# Altium project 2021.PrjPcb
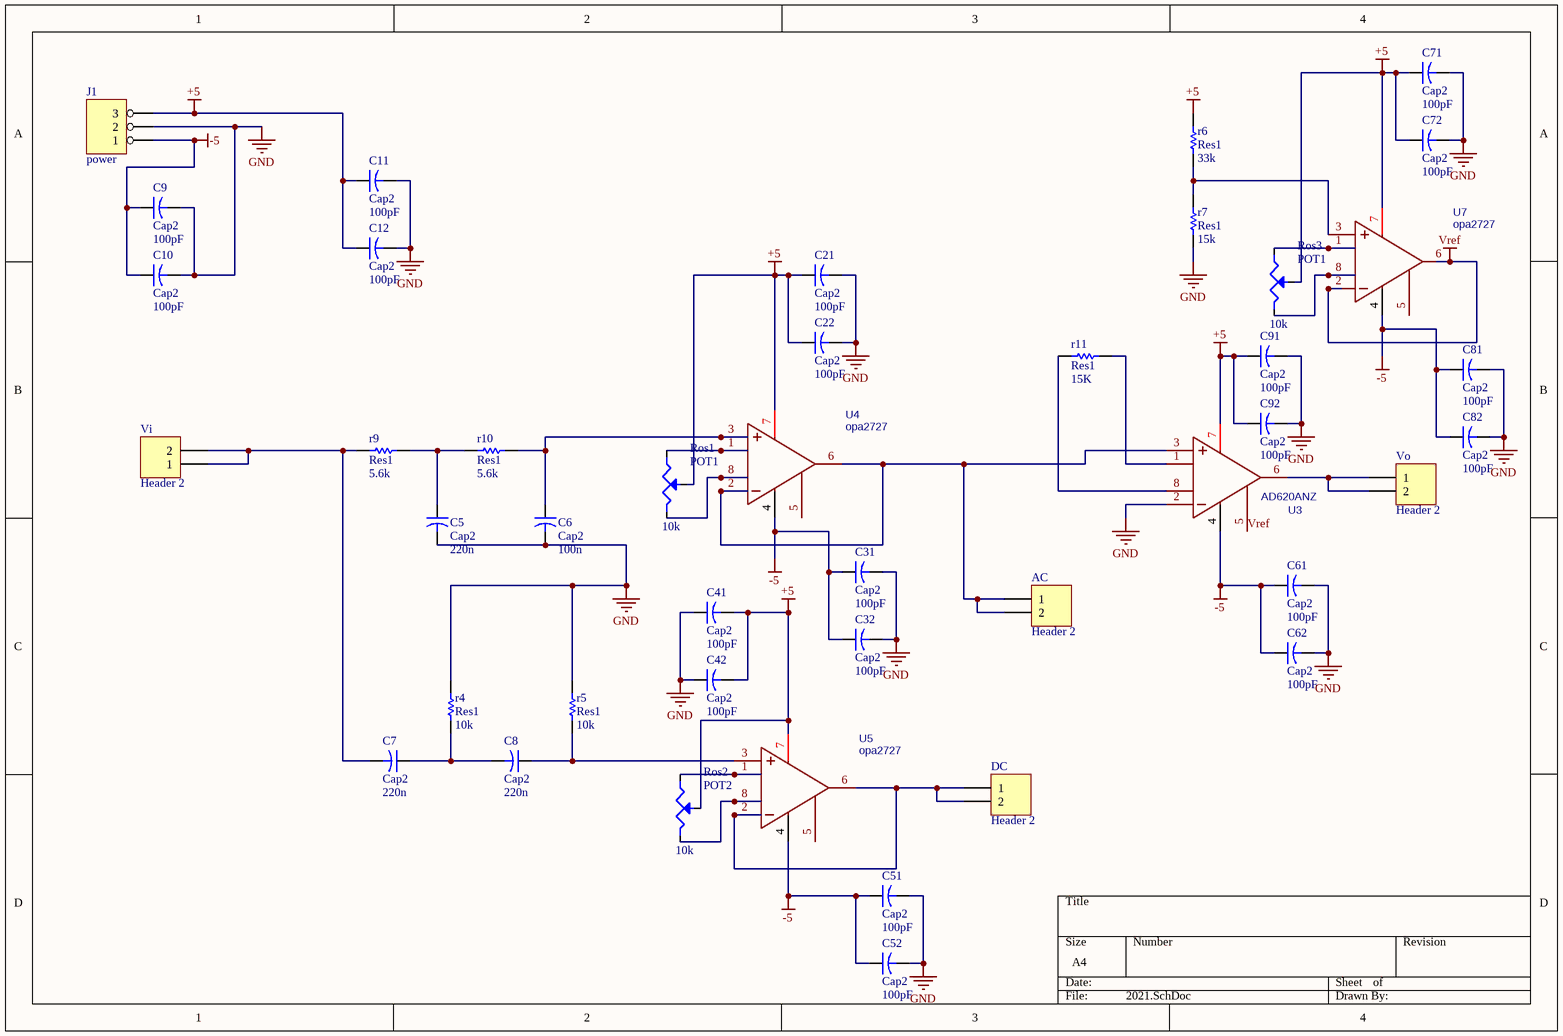
[diagram p0: 2021.SchDoc]
1 sheet, 43 parts. Net scope: global (net labels, ports and power ports of the same name join across sheets).
Board file: 21A.PcbDoc

## Sheet 2021.SchDoc
size A4

### Parts
AC  Header 2  [HDR1X2]
C5  Cap2  value 220n  [RAD0.2]
C6  Cap2  value 100n  [RAD0.2]
C7  Cap2  value 220n  [RAD0.2]
C8  Cap2  value 220n  [RAD0.2]
C9  Cap2  value 100pF  [RAD0.2]
C10  Cap2  value 100pF  [RAD0.2]
C11  Cap2  value 100pF  [RAD0.2]
C12  Cap2  value 100pF  [RAD0.2]
C21  Cap2  value 100pF  [RAD0.2]
C22  Cap2  value 100pF  [RAD0.2]
C31  Cap2  value 100pF  [RAD0.2]
C32  Cap2  value 100pF  [RAD0.2]
C41  Cap2  value 100pF  [RAD0.2]
C42  Cap2  value 100pF  [RAD0.2]
C51  Cap2  value 100pF  [RAD0.2]
C52  Cap2  value 100pF  [RAD0.2]
C61  Cap2  value 100pF  [RAD0.2]
C62  Cap2  value 100pF  [RAD0.2]
C71  Cap2  value 100pF  [RAD0.2]
C72  Cap2  value 100pF  [RAD0.2]
C81  Cap2  value 100pF  [RAD0.2]
C82  Cap2  value 100pF  [RAD0.2]
C91  Cap2  value 100pF  [RAD0.2]
C92  Cap2  value 100pF  [RAD0.2]
DC  Header 2  [HDR1X2]
J1  power  [SIP3]
r4  Res1  value 10k  [AXIAL0.4]
r5  Res1  value 10k  [AXIAL0.4]
r6  Res1  value 33k  [AXIAL-0.4]
r7  Res1  value 15k  [AXIAL0.4]
r9  Res1  value 5.6k  [AXIAL0.4]
r10  Res1  value 5.6k  [AXIAL0.4]
r11  Res1  value 15K  [AXIAL0.4]
Ros1  POT1  value 10k  [VR5]
Ros2  POT2  value 10k  [VR5]
Ros3  POT1  value 10k  [VR5]
U3  AD620ANZ  [DIP8]
U4  opa2727  [DIP8]
U5  opa2727  [DIP8]
U7  opa2727  [DIP8]
Vi  Header 2  [HDR1X2]
Vo  Header 2  [HDR1X2]

### Nets
+5: C11.1 C12.1 C21.1 C22.1 C41.2 C42.2 C71.1 C72.1 C91.1 C92.1 J1.3 r6.2 Ros1.3(W) Ros2.3(W) Ros3.3(W) U3.7(+VS) U4.7(+VS) U5.7(+VS) U7.7(+VS)
-5: C9.1 C10.1 C31.1 C32.1 C51.1 C52.1 C61.1 C62.1 C81.1 C82.1 J1.1 U3.4(-VS) U4.4(-VS) U5.4(-VS) U7.4(-VS)
GND: C5.2 C6.2 C9.2 C10.2 C11.2 C12.2 C21.2 C22.2 C31.2 C32.2 C41.1 C42.1 C51.2 C52.2 C61.2 C62.2 C71.2 C72.2 C81.2 C82.2 C91.2 C92.2 J1.2 r4.2 r5.2 r7.1 U3.2(-IN)
Vref: U3.5(REF) U7.2(-IN) U7.6(OUTPUT)
NetAC_1: AC.1 AC.2 U3.3(+IN) U4.2(-IN) U4.6(OUTPUT)
NetC5_1: C5.1 r9.2 r10.1
NetC6_1: C6.1 r10.2 U4.3(+IN)
NetC7_1: C7.1 C8.2 r4.1
NetC7_2: C7.2 r9.1 Vi.1 Vi.2
NetC8_1: C8.1 r5.1 U5.3(+IN)
NetDC_1: DC.1 DC.2 U5.2(-IN) U5.6(OUTPUT)
Netr6_1: r6.1 r7.2 U7.3(+IN)
Netr11_1: r11.1 U3.8(RG)
Netr11_2: r11.2 U3.1(RG)
NetRos1_1: Ros1.1 U4.1(RG)
NetRos1_2: Ros1.2 U4.8(RG)
NetRos2_1: Ros2.1 U5.1(RG)
NetRos2_2: Ros2.2 U5.8(RG)
NetRos3_1: Ros3.1 U7.1(RG)
NetRos3_2: Ros3.2 U7.8(RG)
NetU3_6: U3.6(OUTPUT) Vo.1 Vo.2

Not connected (* = marked no-connect by the designer): U4 5(REF); U5 5(REF); U7 5(REF)

### Library data of the parts
AC DC Vi Vo = Header 2: Header, 2-Pin; LatestRevisionDate: 17-Jul-2002; LatestRevisionNote: Re-released for DXP Platform.; Publisher: Altium Limited
C5-C12 C21 C22 C31 C32 C41 C42 C51 C52 C61 C62 C71 C72 C81 C82 C91 C92 = Cap2: Capacitor; Published: 23-Sep-2002; PackageReference: CAPR5-4X5; Publisher: Altium Limited
J1 = HEADER 3
r4-r7 r9-r11 = Res1: Resistor; Published: 8-Jun-2000; LatestRevisionDate: 17-Jul-2002; LatestRevisionNote: Re-released for DXP Platform.; PackageReference: AXIAL-0.3; Publisher: Altium Limited
Ros1-Ros3 = POT1: Potentiometer
U3-U5 U7 = AD620ANZ: BOM_Manufacturer: ADI; spicePre: X; BOM_Supplier: LCSC; BOM_Manufacturer Part: AD620ANZ; BOM_Supplier Part: C9680; BOM_JLCPCB Part Class: Extended Part; spiceSymbolName: AD620ANZ